# Altium schematic sheet 海关全向控制器Pad转接板V2.SchDoc
size A4
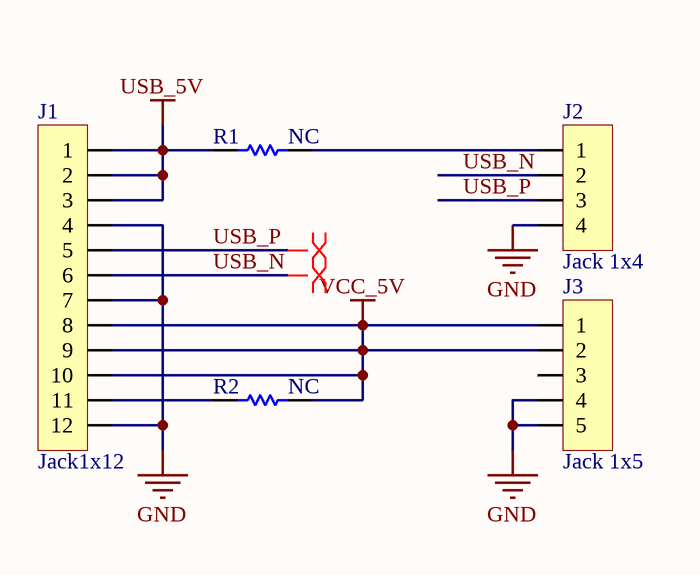
[diagram p0: 海关全向控制器Pad转接板V2.SchDoc]

## Parts
J1  Jack1x12  [PPM.12-711-0102]
J2  Jack 1x4  [ZH-4AWD]
J3  Jack 1x5  [ZH-5AWD]
R1  NC  [R0603]
R2  NC  [R0603]

## Nets
GND: J1.4 J1.7 J1.12 J2.4 J3.4 J3.5
USB_5V: J1.1 J1.2 J1.3 R1.1
VCC_5V: J1.8 J1.9 J1.10 J3.1 J3.2 R2.2
USB_N: J1.6 J2.2
USB_P: J1.5 J2.3
NetJ1_11: J1.11 R2.1
NetJ2_1: J2.1 R1.2

Not connected (* = marked no-connect by the designer): J3 3

## Layout directives
differential pair: USB_N, USB_P

## Library data of the parts
J1 = Jack1x12: 插座
J2 = Jack 1x4: 插座
J3 = Jack 1x5: 插座
R1 R2 = Res